# EAGLE design emonTH V3.0.0 (EAGLE 9.6.2)
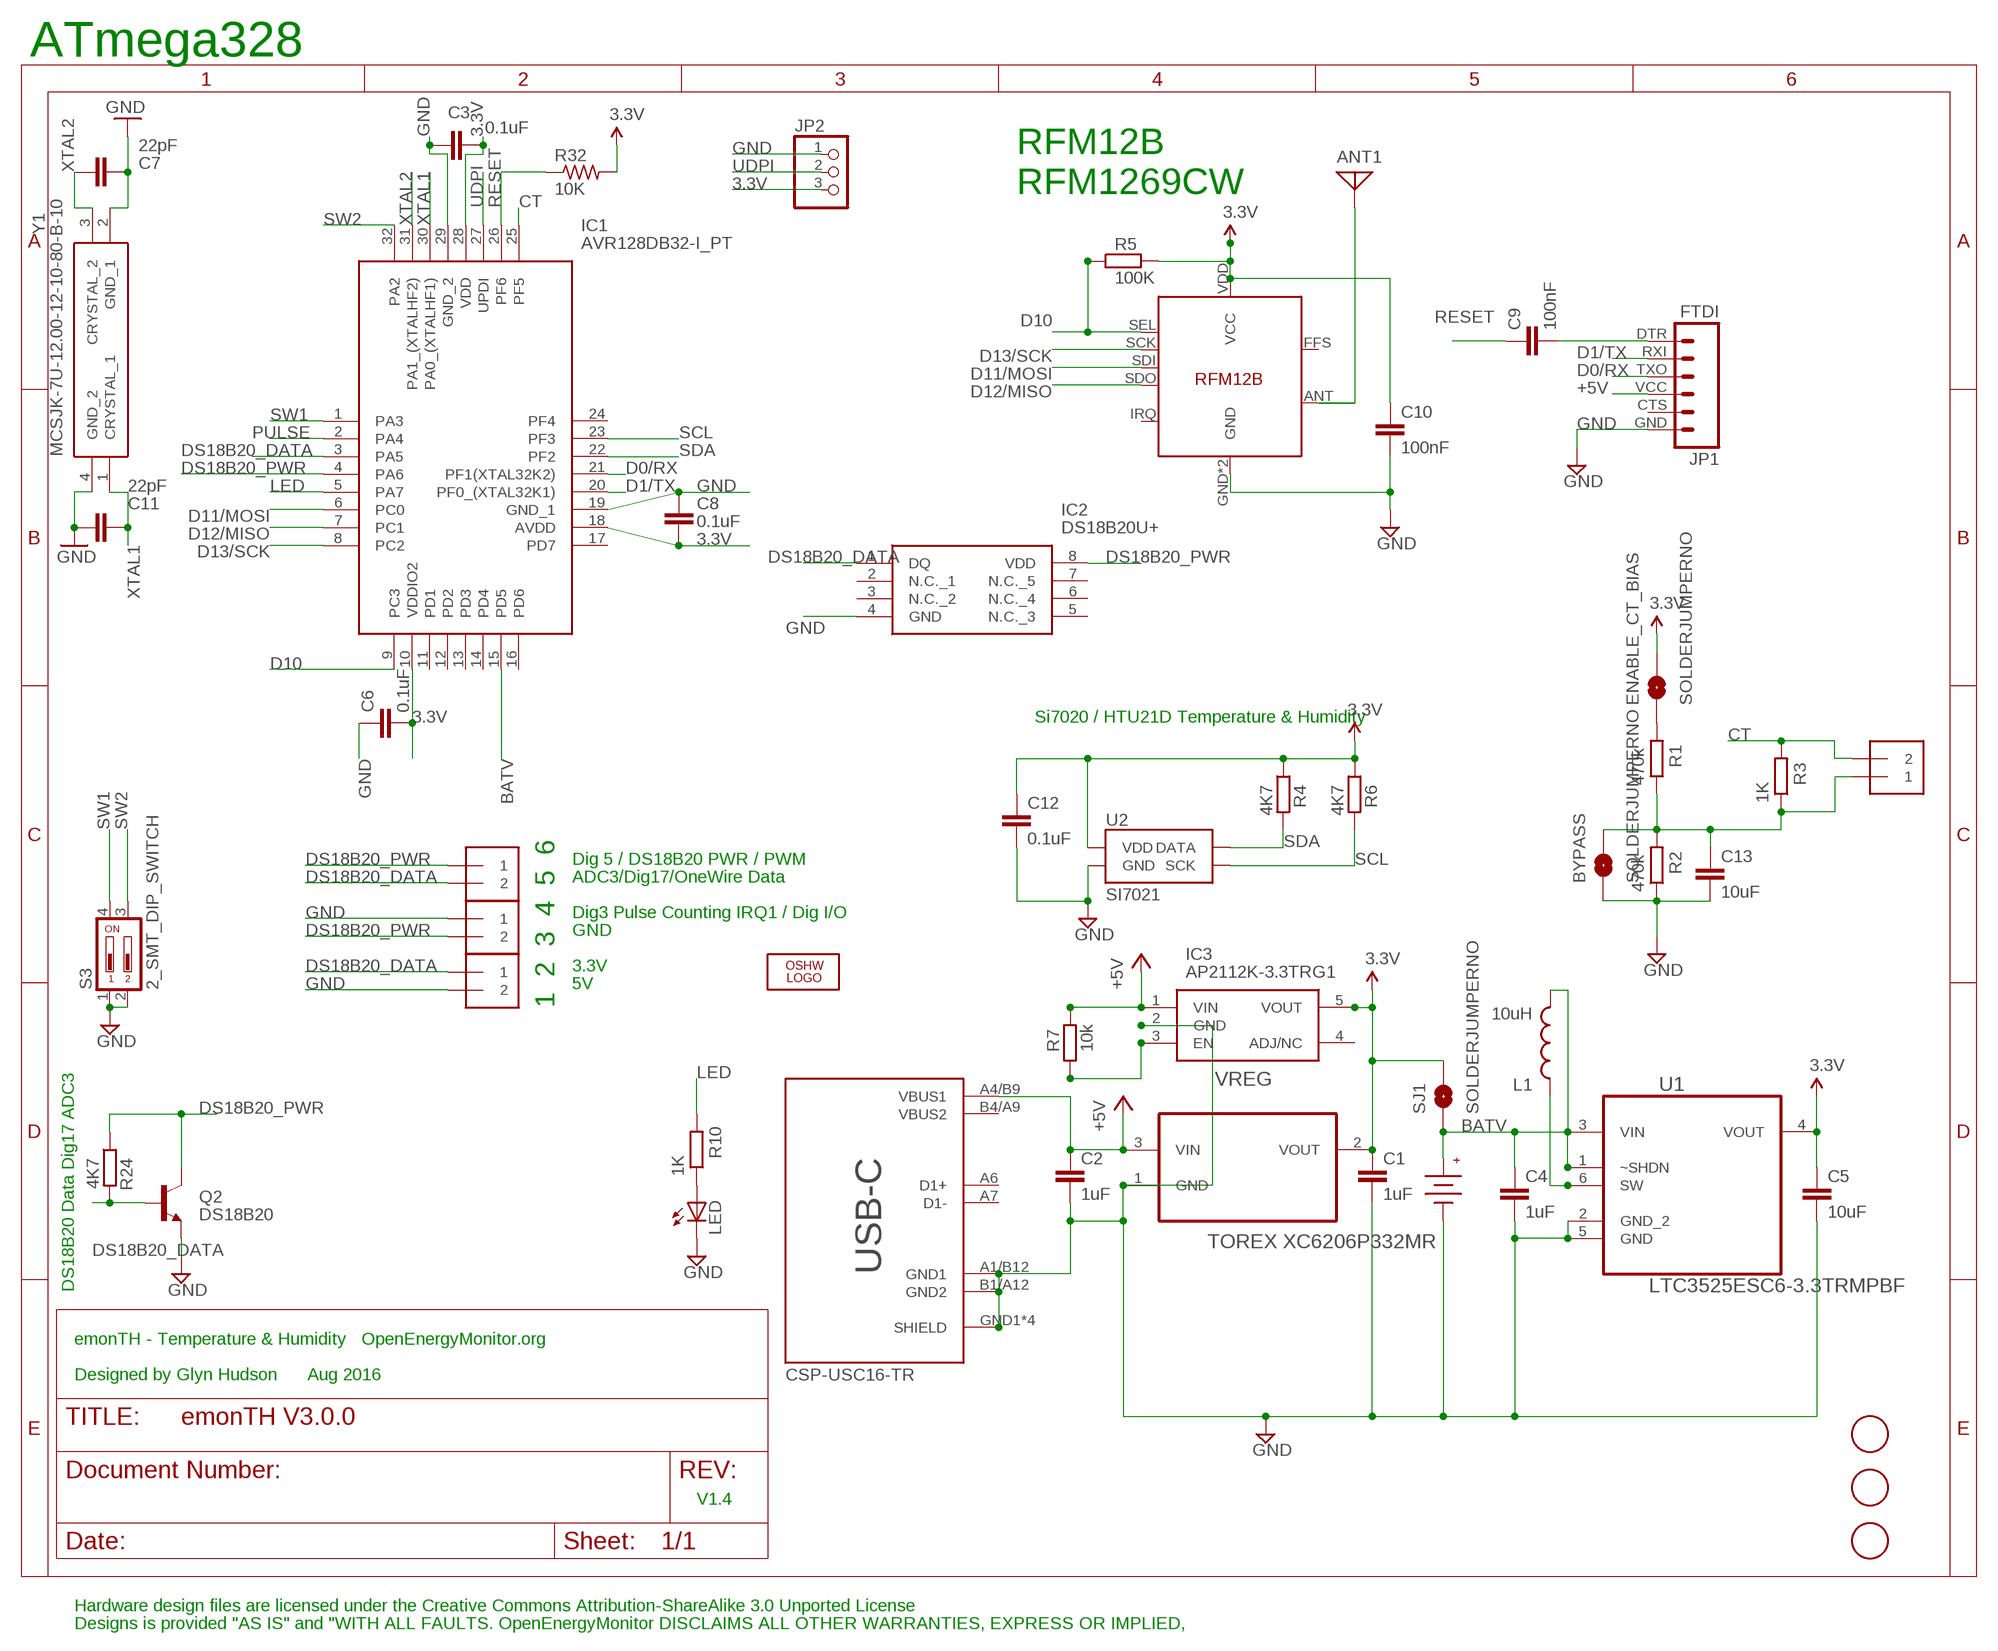
[diagram p0: schematic, sheet 1]

## Parts
ANT1  ANTENNA  [PAD-01]
BYPASS  SOLDERJUMPERNO  [SJ_2S-NO]
C1  1uF  C-EUC0603  [C0603]
C2  1uF  C-EUC0603  [C0603]
C3  0.1uF  C-EUC0603  [C0603]
C4  1uF  C-EUC0603  [C0603]
C5  10uF  C-EUC0603  [C0603]
C6  0.1uF  C-EUC0603  [C0603]
C7  22pF  C-EUC0603  [C0603]
C8  0.1uF  C-EUC0603  [C0603]
C9  100nF  C-EUC0603  [C0603]
C10  100nF  C-EUC0603  [C0603]
C11  22pF  C-EUC0603  [C0603]
C12  0.1uF  C-EUC0603  [C0603]
C13  10uF  C-EUC0603  [C0603]
ENABLE_CT_BIAS  SOLDERJUMPERNO  [SJ_2S-NO]
IC1  AVR128DB32-I_PT  [QFP80P900X900X120-32N]
IC2  DS18B20U+  [SOP65P490X110-8N]
IC3  AP2112K-3.3TRG1  [SOT95P282X130-5N]
J1  1X2-3.5MM  [1X2-3.5MM]
J2  1X2-3.5MM  [1X2-3.5MM]
J3  1X2-3.5MM  [1X2-3.5MM]
J4  1X2-3.5MM  [1X2-3.5MM]
JP1  FTDI  FTDI_BASICPTH  [FTDI_BASIC]
JP2  PINHD-1X3  [1X03]
L1  10uH  INDUCTOR1210  [1210]
LED  LEDCHIPLED-0603-TTW  [CHIPLED-0603-TTW]
LOGO2  OSHW_LOGO_10MILX0200-NT  [OSHW_10X200_NOTEXT]
Q2  DS18B20  TRANSISTOR_NPNTO92  [TO-92]
R1  470k  R-EU_R0603  [R0603]
R2  470k  R-EU_R0603  [R0603]
R3  1K  R-EU_R0603  [R0603]
R4  4K7  R-EU_R0603  [R0603]
R5  100K  R-EU_R0603  [R0603]
R6  4K7  R-EU_R0603  [R0603]
R7  10k  R-EU_R0603  [R0603]
R10  1K  R-EU_R0603  [R0603]
R24  4K7  R-EU_R0603  [R0603]
R32  10K  R-US_R0603  [R0603]
RFM69CW  RFM12B  [RFM12B]
S3  2_SMT_DIP_SWITCH  [DIP_SWITCH_SMT]
SJ1  SOLDERJUMPERNO  [SJ_2S-NO]
U1  LTC3525ESC6-3.3TRMPBF  [SOT65P210X100-6N]
U2  SI7021  [SI7021]
U$1  FIDUCIAL  [FIDUCIAL_1MM]
U$3  3V  3X_AAA_BATTERY_HOLDER  [AAA_PCB_HOLDER]
U$6  FIDUCIAL  [FIDUCIAL_1MM]
U$7  FIDUCIAL  [FIDUCIAL_1MM]
USB-C  CSP-USC16-TR  [USB-C]
VREG  TOREX XC6206P332MR  MCP1700T-3302E/TT  [SOT95P237X112-3N]
Y1  MCSJK-7U-12.00-12-10-80-B-10  [MCSJK7U1200121080B10]

## Nets
3.3V: C1.1 C3.1 C5.1 C6.2 C8.2 C10.1 C12.1 ENABLE_CT_BIAS.2 IC1.10(VDDIO2) IC1.18(AVDD) IC1.28(VDD) IC3.5(VOUT) JP2.3 R4.1 R5.2 R6.1 R32.2 RFM69CW.VDD(VCC) SJ1.2 U1.4(VOUT) U2.VDD VREG.2(VOUT)
+5V [power]: C2.1 IC3.1(VIN) JP1.VCC R7.2 USB-C.A4/B9(VBUS1) VREG.3(VIN)
BATV: C4.1 IC1.15(PD5) L1.2 SJ1.1 U1.1(~SHDN) U1.3(VIN) U$3.+
CT: IC1.25(PF5) J4.2 R3.2
D0/RX: IC1.21(PF1(XTAL32K2)) JP1.TXO
D1/TX: IC1.20(PF0_(XTAL32K1)) JP1.RXI
D10: IC1.9(PC3) R5.1 RFM69CW.SEL
D11/MOSI: IC1.6(PC0) RFM69CW.SDI
D12/MISO: IC1.7(PC1) RFM69CW.SDO
D13/SCK: IC1.8(PC2) RFM69CW.SCK
DIG1: ANT1.1 RFM69CW.ANT
DS18B20_DATA: IC1.3(PA5) IC2.1(DQ) J1.2 J3.1 Q2.2(B) R24.2
DS18B20_PWR: IC1.4(PA6) IC2.8(VDD) J1.1 J2.2 Q2.3(C) R24.1
GND [gnd]: BYPASS.1 C1.2 C2.2 C3.2 C4.2 C5.2 C6.1 C7.1 C8.1 C10.2 C11.2 C12.2 C13.2 IC1.19(GND_1) IC1.29(GND_2) IC2.4(GND) IC3.2(GND) J2.1 J3.2 JP1.GND JP2.1 LED.C Q2.1(E) R2.1 RFM69CW.GND RFM69CW.P$12(GND) S3.1 S3.2 U1.2(GND_2) U1.5(GND) U2.GND U$3.- USB-C.A1/B12(GND1) USB-C.B1/A12(GND2) USB-C.GND1(SHIELD) USB-C.GND2(SHIELD) USB-C.GND3(SHIELD) USB-C.GND4(SHIELD) VREG.1(GND) Y1.2(GND_1) Y1.4(GND_2)
LED: IC1.5(PA7) R10.2
N$1: LED.A R10.1
N$2: ENABLE_CT_BIAS.1 R1.2
N$3: BYPASS.2 C13.1 J4.1 R1.1 R2.2 R3.1
N$5: L1.1 U1.6(SW)
N$13: IC3.3(EN) R7.1
N$23: C9.2 JP1.DTR
PULSE: IC1.2(PA4)
RESET: C9.1 IC1.26(PF6) R32.1
SCL: IC1.23(PF3) R6.2 U2.SCK
SDA: IC1.22(PF2) R4.2 U2.DATA
SW1: IC1.1(PA3) S3.4
SW2: IC1.32(PA2) S3.3
UDPI: IC1.27(UPDI) JP2.2
XTAL1: C11.1 IC1.30(PA0_(XTALHF1)) Y1.1(CRYSTAL_1)
XTAL2: C7.2 IC1.31(PA1_(XTALHF2)) Y1.3(CRYSTAL_2)
Unconnected: IC1.11(PD1) IC1.12(PD2) IC1.13(PD3) IC1.14(PD4) IC1.16(PD6) IC1.17(PD7) IC1.24(PF4) IC2.2(N.C._1) IC2.3(N.C._2) IC2.5(N.C._3) IC2.6(N.C._4) IC2.7(N.C._5) IC3.4(ADJ/NC) JP1.CTS RFM69CW.FFS RFM69CW.IRQ USB-C.A6(D1+) USB-C.A7(D1-) USB-C.B4/A9(VBUS2)

## Notes on the sheet
- ATmega328
- RFM12B
  RFM1269CW
- Si7020 / HTU21D Temperature & Humidity
- Dig 5 / DS18B20 PWR / PWM
- ADC3/Dig17/OneWire Data
- Dig3 Pulse Counting IRQ1 / Dig I/O
- GND
- 3.3V
- 5V
- 1  2  3  4  5  6
- DS18B20 Data Dig17 ADC3
- emonTH - Temperature & Humidity   OpenEnergyMonitor.org
- Designed by Glyn Hudson      Aug 2016
- V1.4
- Hardware design files are licensed under the Creative Commons Attribution-ShareAlike 3.0 Unported License
- Designs is provided "AS IS" and "WITH ALL FAULTS. OpenEnergyMonitor DISCLAIMS ALL OTHER WARRANTIES, EXPRESS OR IMPLIED,

## Library data of the parts
ANT1 = discrete:ANTENNA: Antenna
BYPASS ENABLE_CT_BIAS SJ1 = SparkFun:SOLDERJUMPER: Solder Jumper Standard SMD solder jumper. Used to automate production. Two varients : Normally Open and Normally Closed are the same, but have different paste layers. NC will have a large amount of paste and should jumper during reflow.
C1 C2 C4-C8 C11-C13 = resistor:C-EU: CAPACITOR, European symbol
C3 C9 C10 = rcl:C-EU: CAPACITOR, European symbol
IC1 = AVR128DB32-I_PT:AVR128DB32-I_PT: 128KB, TQFP32, 85C, 24MHZ, 12B ADC, COMP, OPAMP, MVIO, ZCD, DAC, UART, SPI, TWI, 32 TQFP 7X7X1MM TRAY ROHS COMPLIANT: YES Source: Datasheet <http://ww1.microchip.com/downloads/en/DeviceDoc/AVR128DB28-32-48-64-DataSheet-DS40002247A.pdf>; ARROW_PART_NUMBER: AVR128DB32-I/PT; ARROW_PRICE-STOCK: https://www.arrow.com/en/products/avr128db32-ipt/microchip-technology?region=nac; DESCRIPTION: 128KB, TQFP32, 85C, 24MHZ, 12B ADC, COMP, OPAMP, MVIO, ZCD, DAC, UART, SPI, TWI, 32 TQFP 7X7X1MM TRAY ROHS COMPLIANT: YES; HEIGHT: 1.2mm; MANUFACTURER_NAME: Microchip; MANUFACTURER_PART_NUMBER: AVR128DB32-I/PT; MOUSER_PART_NUMBER: 579-AVR128DB32-I/PT; MOUSER_PRICE-STOCK: https://www.mouser.co.uk/ProductDetail/Microchip-Technology/AVR128DB32-I-PT?qs=vmHwEFxEFR%252BrKeBb9KOKBg%3D%3D
IC2 = DS18B20U+:DS18B20U+: Board Mount Temperature Sensors Prgmble Resolution 1-Wire Parasite Pwr Source: Datasheet <https://datasheets.maximintegrated.com/en/ds/DS18B20.pdf>; ARROW_PART_NUMBER: DS18B20U+; ARROW_PRICE-STOCK: https://www.arrow.com/en/products/ds18b20u/maxim-integrated?region=nac; DESCRIPTION: Board Mount Temperature Sensors Prgmble Resolution 1-Wire Parasite Pwr; HEIGHT: 1.1mm; MANUFACTURER_NAME: Maxim Integrated; MANUFACTURER_PART_NUMBER: DS18B20U+; MOUSER_PART_NUMBER: 700-DS18B20U; MOUSER_PRICE-STOCK: https://www.mouser.co.uk/ProductDetail/Maxim-Integrated/DS18B20U%2b?qs=7H2Jq%252ByxpJLxAEcPXZtrFQ%3D%3D
IC3 = AP2112K-3.3TRG1:AP2112K-3.3TRG1: 600mA 3.3V LDO Regulator Enable SOT23-5 DiodesZetex AP2112K-3.3TRG1, LDO Voltage Regulator, 3.3 V +/-1.5%, 2.5 6 Vin, 5-Pin SOT-23 Source: Datasheet <http://uk.rs-online.com/web/p/products/8283509>; ARROW_PART_NUMBER: AP2112K-3.3TRG1; ARROW_PRICE-STOCK: https://www.arrow.com/en/products/ap2112k-3.3trg1/diodes-incorporated?region=nac; DESCRIPTION: 600mA 3.3V LDO Regulator Enable SOT23-5 DiodesZetex AP2112K-3.3TRG1, LDO Voltage Regulator, 3.3 V +/-1.5%, 2.5 6 Vin, 5-Pin SOT-23; HEIGHT: 1.3mm; MANUFACTURER_NAME: Diodes Inc.; MANUFACTURER_PART_NUMBER: AP2112K-3.3TRG1; MOUSER_PART_NUMBER: 621-AP2112K-3.3TRG1; MOUSER_PRICE-STOCK: https://www.mouser.co.uk/ProductDetail/Diodes-Incorporated/AP2112K-33TRG1?qs=x6A8l6qLYDDPYHosCdzh%2FA%3D%3D
J1-J4 = adafruit:1X2: 3.5mm Terminal block http://www.ladyada.net/library/pcb/eaglelibrary.html
JP1 = SparkFun:FTDI_BASIC: FTDI Basic: 3.3V and 5V
JP2 = adafruit:PINHD-1X3: PIN HEADER
L1 = SparkFun:INDUCTOR: Inductors Basic Inductor/Choke - 0603 and 1206. Footprints are not proven and vary greatly between part numbers.
LED = adafruit:LED: LED OSRAM: - CHIPLED LG R971, LG N971, LY N971, LG Q971, LY Q971, LO R971, LY R971 LH N974, LH R974 LS Q976, LO Q976, LY Q976 LO Q996 - Hyper CHIPLED LW Q18S LB Q993, LB Q99A, LB R99A - SideLED LS A670, LO A670, LY A670, LG A670, LP A670 LB A673, LV A673, LT A673, LW A673 LH A674 LY A675 LS A676, LA A676, LO A676, LY A676, LW A676 LS A679, LY A679, LG A679 - Hyper Micro SIDELED® LS Y876, LA Y876, LO Y876, LY Y876 LT Y87S - SmartLED LW L88C, LW L88S LB L89C, LB L89S, LG L890 LS L89K, LO L89K, LY L89K LS L896, LA L896, LO L896, LY L896 - TOPLED LS T670, LO T670, LY T670, LG T670, LP T670 LSG T670, LSP T670, LSY T670, LOP T670, LYG T670 LG T671, LOG T671, LSG T671 LB T673, LV T673, LT T673, LW T673 LH T674 LS T676, LA T676, LO T676, LY T676, LB T676, LH T676, LSB T676, LW T676 LB T67C, LV T67C, LT T67C, LS T67K, LO T67K, LY T67K, LW E67C LS E67B, LA E67B, LO E67B, LY E67B, LB E67C, LV E67C, LT E67C LW T67C LS T679, LY T679, LG T679 LS T770, LO T770, LY T770, LG T770, LP T770 LB T773, LV T773, LT T773, LW T773 LH T774 LS E675, LA E675, LY E675, LS T675 LS T776, LA T776, LO T776, LY T776, LB T776 LHGB T686 LT T68C, LB T68C - Hyper Mini TOPLED® LB M676 - Mini TOPLED Santana® LG M470 LS M47K, LO M47K, LY M47K Source: http://www.osram.convergy.de/
LOGO2 = ohw-logo:OSHW_LOGO_10MIL
Q2 = SparkFun:TRANSISTOR_NPN: Transistor NPN BJT configuration in SOT23 package. MMBT2222 is the common NPN we use. Double check BCE configuration again layout.
R1-R4 R6 R10 R24 = resistor:R-EU_: RESISTOR, European symbol
R5 R7 = rcl:R-EU_: RESISTOR, European symbol
R32 = adafruit:R-US_: RESISTOR, American symbol
RFM69CW = JeeParts:RFM12B
S3 = OpenEnergyMonitor:2_SMT_DIP_SWITCH: Multicomp MCEMR-02-T 2 throw SMT DIP switch, Farnell 1524005
U1 = LTC3525:LTC3525ESC6-3.3TRMPBF: Step-Up DC/DC Converter; MPN: LTC3525ESC6-3.3#TRMPBF; OC_FARNELL: 1663904; OC_NEWARK: 19P0692; PACKAGE: SC70-6; SUPPLIER: LINEAR TECHNOLOGY
U2 = SparkFun-Sensors:SI7021: The Si7021 is an I2C Humidity and Temperature Sensor; PROD_ID: IC-13093
U$1 U$6 U$7 = adafruit:FIDUCIAL: For use by pick and place machines to calibrate the vision/machine, 1mm By microbuilder.eu
U$3 = Battery Holders_2xAA:3X_AAA_BATTERY_HOLDER: 2x AA Battery Holder; RAPID_OC: 18-2967
USB-C = CSP-USC16-TR:CSP-USC16-TR: CSP-USC16-TR TOBY.CO.UK; MPN: CSP-USC16-TR
VREG = Farnell_MCP1700-SOT23:MCP1700T-3302E/TT: Low Quiescent Current LDO; MPN: MCP1700T-3302E/TT; OC_FARNELL: 1296592; OC_NEWARK: 88H9817; PACKAGE: SOT23-3; SUPPLIER: Microchip
Y1 = MCSJK-7U-12.00-12-10-80-B-10:MCSJK-7U-12.00-12-10-80-B-10: CRYSTAL, 12MHZ, 12PF, 3.2MM X 2.5MM Source: Datasheet <https://componentsearchengine.com/Datasheets/2/MCSJK-7U-12.00-12-10-80-B-10.pdf>; DESCRIPTION: CRYSTAL, 12MHZ, 12PF, 3.2MM X 2.5MM; HEIGHT: 0.8mm; MANUFACTURER_NAME: MULTICOMP; MANUFACTURER_PART_NUMBER: MCSJK-7U-12.00-12-10-80-B-10

## Net classes
0 default: width 0.203 mm, drill 0.6 mm, clearance 0.203 mm
1 power: width 0.305 mm, drill 0.6 mm, clearance 0.254 mm
2 gnd: width 0.254 mm, drill 0.6 mm, clearance 0.254 mm

## Board
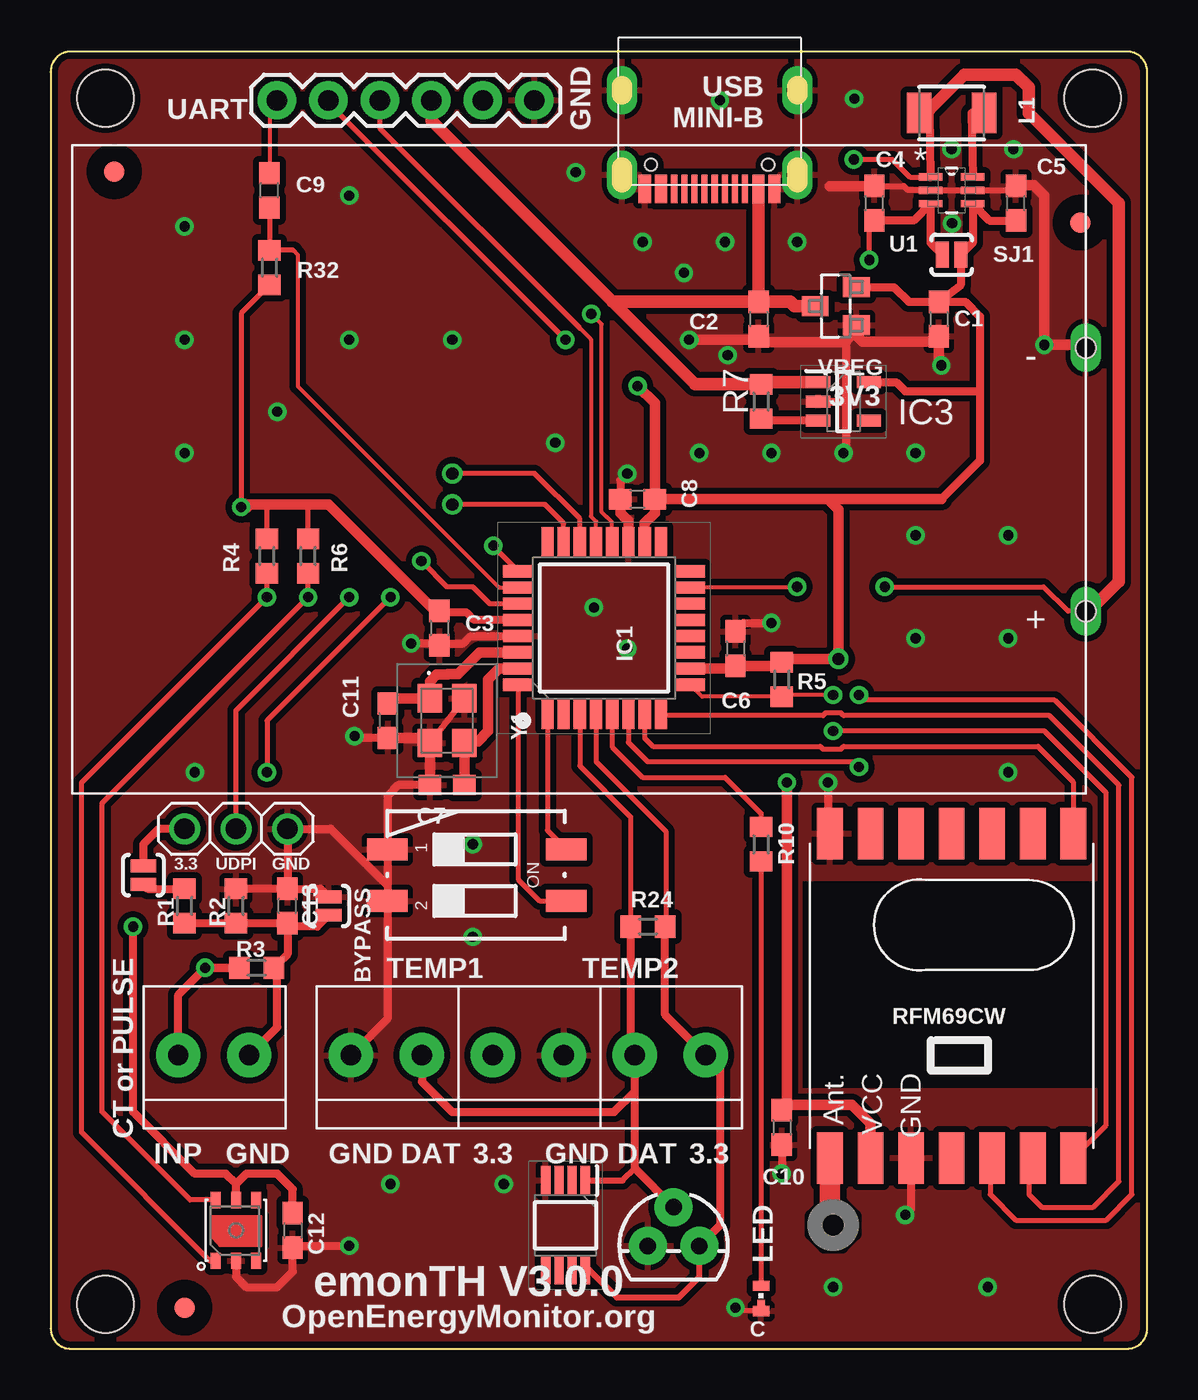
[diagram p1: board, top side]
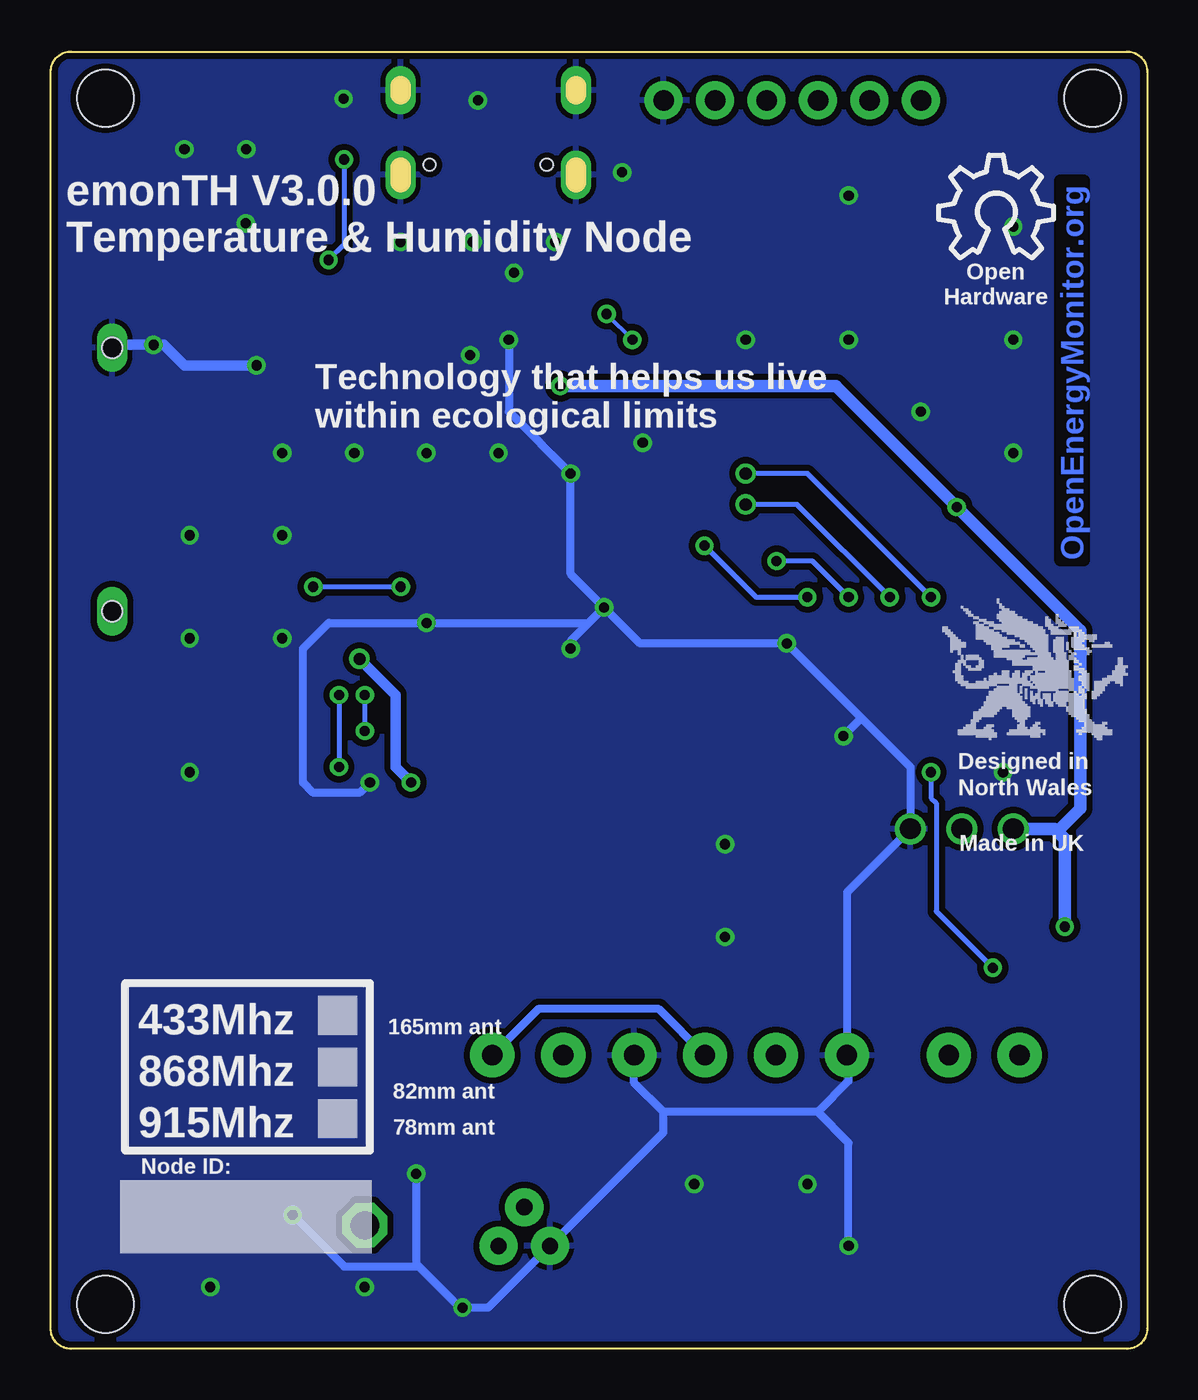
[diagram p2: board, bottom side, seen from below]

Size 54.1 x 64 mm. Coordinates in mm from the lower left corner, seen from the top.
Outline: 53.1,64 1,64 arc90 0,63 0,1 arc90 1,0 53.1,0 arc90 54.1,1 54.1,63 arc90 53.1,64
Copper layers (1*16): Top 0.035mm / dielectric 1.5mm / Bottom 0.035mm
Design rules "default *": minimum track width 8mil, minimum drill 0.5mm, track to track 8mil, track to pad 8mil, pad to pad 8mil, via to via 8mil, smd to smd 8mil, copper to edge 10mil, drill to drill 8mil, minimum pad ring 8mil, minimum via ring 8mil, stop-mask expansion 0.075mm, vias tented up to drill 0.6mm, thermal gap 10mil
Holes 2.8 mm at 2.7,2.2 2.7,61.7 51.4,61.7 51.4,2.2

### Footprints (pad centres in the part's own frame; a part is rotated, then mirrored left to right if it is on the bottom)
PAD-01 = drill 1.4 pad 2.2 octagon: 1 0,0
SJ_2S-NO = smd 0.635 x 1.27: 1 -0.45,0; 2 0.45,0
C0603 = smd 1.1 x 1: 1 -0.85,0; 2 0.85,0
QFP80P900X900X120-32N = smd 1.475 x 0.6: 1 -4.238,2.8; 2 -4.238,2; 3 -4.238,1.2; 4 -4.238,0.4; 5 -4.238,-0.4; 6 -4.238,-1.2; 7 -4.238,-2; 8 -4.238,-2.8; 17 4.238,-2.8; 18 4.238,-2; 19 4.238,-1.2; 20 4.238,-0.4; 21 4.238,0.4; 22 4.238,1.2; 23 4.238,2; 24 4.238,2.8 | smd 0.6 x 1.475: 9 -2.8,-4.238; 10 -2,-4.238; 11 -1.2,-4.238; 12 -0.4,-4.238; 13 0.4,-4.238; 14 1.2,-4.238; 15 2,-4.238; 16 2.8,-4.238; 25 2.8,4.238; 26 2,4.238; 27 1.2,4.238; 28 0.4,4.238; 29 -0.4,4.238; 30 -1.2,4.238; 31 -2,4.238; 32 -2.8,4.238
SOP65P490X110-8N = smd 1.425 x 0.45: 1 -2.212,0.975; 2 -2.212,0.325; 3 -2.212,-0.325; 4 -2.212,-0.975; 5 2.212,-0.975; 6 2.212,-0.325; 7 2.212,0.325; 8 2.212,0.975
SOT95P282X130-5N = smd 1.2 x 0.6: 1 -1.25,0.95; 2 -1.25,0; 3 -1.25,-0.95; 4 1.25,-0.95; 5 1.25,0.95
1X2-3.5MM = drill 1 pad 2.184: 1 1.8,0; 2 -1.7,0
FTDI_BASIC = drill 1.016 pad 1.88: CTS 10.16,0; DTR 0,0; GND 12.7,0; RXI 2.54,0; TXO 5.08,0; VCC 7.62,0
1X03 = drill 1.016: 1 -2.54,0; 2 0,0; 3 2.54,0
1210 = smd 1.2 x 2: 1 -1.6,0; 2 1.6,0
CHIPLED-0603-TTW = smd 0.8 x 0.5: A 0,-0.575; C 0,0.675 | smd 0.35 x 0.35: C@1 0,0.3
TO-92 = drill 0.813 pad 1.88: 1 -1.27,0; 2 0,1.905; 3 1.27,0
R0603 = smd 1 x 1.1: 1 -0.85,0; 2 0.85,0
RFM12B = smd 2.54 x 1.27: ANT 8,-6; FFS -8,2; GND 8,-2; IRQ -8,4; P$8 -8,0; P$9 -8,-2; P$10 -8,-4; P$12 -8,-6; P$16 8,0; SCK 8,4; SDI 8,2; SDO -8,6; SEL 8,6; VDD 8,-4
DIP_SWITCH_SMT = smd 1.1 x 2: 1 -1.27,-4.215; 2 1.27,-4.215; 3 1.27,4.615; 4 -1.27,4.615
SOT65P210X100-6N = smd 1.168 x 0.356: 1 -1.041,0.66; 2 -1.041,0; 3 -1.041,-0.66; 4 1.041,-0.66; 5 1.041,0; 6 1.041,0.66
SI7021 = smd 0.8 x 0.5: DATA 1.5,-1; GND 1.5,0; NC@3 1.5,1; NC@4 -1.5,1; SCK -1.5,-1; VDD -1.5,0
FIDUCIAL_1MM = smd 1 x 1: 1 0,0
AAA_PCB_HOLDER = drill 1 long: + 0,9; - 0,22 | hole 1: 0,9; 0,22
USB-C = smd 0.6 x 1.4: A1/B12 -3.2,0.7; A4/B9 -2.4,0.7; B1/A12 3.2,0.7; B4/A9 2.4,0.7 | smd 0.3 x 1.4: A5 -1.25,0.7; A6 -0.25,0.7; A7 0.25,0.7; A8 1.25,0.7; B5 1.75,0.7; B6 0.75,0.7; B7 -0.75,0.7; B8 -1.75,0.7 | drill 1 pad 1.2 long: GND1 -4.32,0; GND2 4.33,0; GND3 4.33,-4.18; GND4 -4.32,-4.18 | hole 0.6: -2.89,-0.5; 2.89,-0.5
SOT95P237X112-3N = smd 0.991 x 1.321: 1 -0.94,-1.016; 2 0.94,-1.016; 3 0,1.016
MCSJK7U1200121080B10 = smd 1.4 x 1.2: 1 -1.1,-0.85; 2 1.1,-0.85; 3 1.1,0.85; 4 -1.1,0.85

### Placement (x,y rotation side)
ANT1  38.61,6.1 0 top
BYPASS  13.72,21.84 270 top
C1  43.81,50.8 270 top
C2  34.92,50.8 270 top
C3  19.18,35.56 270 top
C4  40.64,56.52 90 top
C5  47.62,56.52 90 top
C6  33.78,34.54 270 top
C7  19.56,27.81 0 top
C8  28.96,41.91 0 top
C9  10.79,57.15 90 top
C10  36.07,10.92 270 top
C11  16.64,30.99 270 top
C12  11.94,5.84 270 top
C13  11.68,21.84 90 top
ENABLE_CT_BIAS  4.57,23.37 90 top
IC1  27.3,35.56 90 top
IC2  25.4,6.1 270 top
IC3  39.12,46.74 0 top
J1  30.52,14.48 0 top
J2  23.52,14.48 0 top
J3  16.52,14.48 0 top
J4  7.99,14.48 0 top
JP1  11.16,61.59 0 top
JP2  9.14,25.65 180 top
L1  44.45,60.96 180 top
LED  35.05,2.54 180 top
LOGO2  10.29,53.81 0 bottom
Q2  30.73,5.08 0 top
R1  6.6,21.84 90 top
R2  9.14,21.84 270 top
R3  10.16,18.8 180 top
R4  10.67,39.12 270 top
R5  36.07,33.02 90 top
R6  12.7,39.12 270 top
R7  35.05,46.74 90 top
R10  35.05,24.89 90 top
R24  29.46,20.83 180 top
R32  10.79,53.34 270 top
RFM69CW  44.45,17.41 270 top
S3  20.83,23.37 270 top
SJ1  44.45,53.98 0 top
U1  44.45,57.15 0 top
U2  9.14,5.84 270 top
U$1  6.6,2.03 0 top
U$3  51.07,27.39 0 top
U$6  3.13,58.08 0 top
U$7  50.8,55.56 0 top
USB-C  32.51,57.91 180 top
VREG  38.73,51.44 90 top
Y1  19.56,30.99 270 top

### Tracks (layer width: path | path; a pad name or v marks a point on that pad's centre or on a via)
3.3V  (via drill 0.5, 0.6)
  Top 0.254: R32.2 9.4,51.09 v9.4,41.53 | 12.7,40.13 R6.1 12.7,41.66 | R4.1 10.67,41.66
  Top 0.406: C1.1 44.9,52.48 SJ1.2 45.49,54.57 U1.4 46.32,55.66 C5.1 | VREG.2 41.6,52.38 42.33,51.65 C1.1 | C1.1 45.12,51.65 45.85,50.93 45.85,47.24 | 45.85,47.24 45.85,43.81 43.94,41.91 | IC1.28 20.9,35.96 20.54,36.32 19.27,36.32 C3.1 | C12.1 11.94,7.87 11.18,8.64 9.65,8.64 9.14,8.13 | JP2.3 5.33,25.65 4.57,24.89 ENABLE_CT_BIAS.2 | U2.VDD 9.14,8.13 | 9.14,8.13 8.64,8.64 7.11,8.64 4.06,11.68 v4.06,20.83 | 36.23,34.04 R5.2 35.89,33.69 | IC3.5 41.72,47.69 42.16,47.24 45.85,47.24
  Top 0.508: IC1.10 33.65,33.56 C6.2 35.89,33.69 | IC1.18 29.3,40.73 29.81,41.24 C8.2 | 38.35,41.91 38.86,41.4 v38.86,34.04 | 43.94,41.91 38.35,41.91 | 38.35,41.91 C8.2 | v28.96,47.5 29.81,46.65 C8.2 | 38.77,34.12 v38.86,34.04 | v36.32,27.94 36.32,12.03 | 36.32,12.03 39.54,12.03 40.45,11.11 RFM69CW.VDD | 9.53,41.66 10.67,41.66 12.7,41.66 13.72,41.66 19.05,36.32 19.27,36.32 | 36.23,34.04 v38.86,34.04 | C10.1 36.32,12.03
  Top 0.61: 9.65,41.53 v9.4,41.53 9.53,41.66 | C3.1 19.09,36.32
  Bottom 0.406: 4.57,25.65 4.32,25.65
  Bottom 0.508: v36.32,27.94 37.08,28.7 37.08,32.26 v38.86,34.04
  Bottom 0.61: v28.96,47.5 15.37,47.5 v9.4,41.53 3.3,35.43 3.3,26.67 4.32,25.65 | JP2.3 4.57,25.65 4.06,25.15 v4.06,20.83
+5V
  Top 0.254: 34.62,51.65 C2.1
  Top 0.406: R7.2 35.07,47.6 35.3,47.6 35.38,47.69
  Top 0.61: 27.73,51.65 18.78,60.59 JP1.VCC | 27.73,51.65 C2.1 | C2.1 36.49,51.65 36.7,51.44 VREG.3 | 35.38,47.69 IC3.1 | R7.2 31.79,47.59 27.73,51.65 | USB-C.A4/B9 34.91,51.66 C2.1
BATV  (via drill 0.5)
  Top 0.203: IC1.15 31.57,37.59 v36.83,37.59
  Top 0.254: 43.38,57.78 42.42,57.78 41.53,58.67 v39.62,58.67 | v40.39,53.72 40.39,55.41 C4.1 | v41.15,37.59 48.98,37.59 50.19,36.39 U$3.+
  Top 0.406: L1.2 43.34,60.97 | 43.34,60.97 U1.1 43.38,57.78 | SJ1.1 43.41,54.57 U1.3 42.58,55.66 C4.1 | 43.34,60.97 43.34,61.12
  Top 0.61: U$3.+ 51.25,36.39 52.7,37.85 52.7,56.52 48.26,60.96 48.26,62.23 47.62,62.87 45.09,62.87 43.34,61.12
  Bottom 0.254: v39.62,58.67 39.62,54.48 v40.39,53.72 | v36.83,37.59 v41.15,37.59
CT  (via drill 0.5)
  Top 0.254: IC1.25 21.84,39.58 v21.84,39.62 | v10.67,28.45 10.67,30.99 v16.76,37.08
  Top 0.406: v7.62,18.8 6.29,17.47 J4.2 | v7.62,18.8 R3.2 v7.62,18.8
  Bottom 0.254: v21.84,39.62 19.3,37.08 v16.76,37.08 | v10.67,28.45 10.67,27.18 10.41,26.92 10.41,21.59 v7.62,18.8
D0/RX
  Top 0.203: IC1.21 26.91,40.81 26.65,41.07 26.65,49.8 26.11,50.35
  Top 0.254: 26.11,50.35 16.26,60.2 16.26,61.58 JP1.TXO
D1/TX  (via drill 0.5)
  Top 0.203: IC1.20 27.69,39.82 27.69,40.79 27.43,41.05 27.41,41.05 27.18,41.28 27.18,50.55 v26.67,51.05
  Top 0.254: v25.4,49.78 13.7,61.48 JP1.RXI
  Bottom 0.203: v26.67,51.05 v25.4,49.78
D10  (via drill 0.5)
  Top 0.203: v38.61,32.26 36.16,32.26 R5.1 32.13,32.17 IC1.9
  Top 0.254: RFM69CW.SEL 52.07,11.04 52.07,27.43 49.02,30.48 v38.61,30.48
  Bottom 0.254: v38.61,32.26 v38.61,30.48
D11/MOSI  (via drill 0.5)
  Top 0.254: RFM69CW.SDI 46.35,9.32 46.35,7.62 47.62,6.35 52.07,6.35 53.34,7.62 53.34,28.19 49.53,32 40.13,32 v39.88,32.26 | IC1.6 28.5,29.91 29.46,28.96 39.62,28.96 v39.88,28.7
  Bottom 0.254: v39.88,32.26 v39.88,28.7
D12/MISO
  Top 0.254: RFM69CW.SDO 50.45,27.97 48.7,29.72 39.12,29.72 38.99,29.59 38.1,29.59 37.97,29.72 29.72,29.72 29.3,30.13 IC1.7 29.46,31.16
D13/SCK
  Top 0.254: RFM69CW.SCK 48.26,9.22 48.26,7.62 48.9,6.99 51.44,6.99 52.7,8.26 52.7,27.81 49.28,31.24 39.12,31.24 38.99,31.37 38.23,31.37 38.1,31.24 30.18,31.24 IC1.8
DIG1
  Top 1.016: 38.42,9.38 RFM69CW.ANT 38.45,6.25 ANT1.1
DS18B20_DATA
  Top 0.254: 28.61,21.34 R24.2 28.61,26.25 26.11,28.76 IC1.3
  Top 0.305: IC2.1 28.22,8.31 28.82,8.9
  Top 0.406: Q2.2 28.82,8.9 28.82,12.7 | 28.82,12.7 J1.2 28.61,14.69 R24.2 | J3.1 18.32,13.18 19.81,11.68 27.8,11.68 28.82,12.7
DS18B20_PWR
  Top 0.254: IC1.4 26.91,28.98 30.35,25.53 30.35,20.87
  Top 0.305: IC2.8 26.6,3.88 27.94,2.54 30.99,2.54 32,3.56 Q2.3
  Top 0.406: 30.35,20.87 R24.1 30.31,16.49 J1.1 33.02,13.78 33.02,6.1 Q2.3
  Bottom 0.406: J2.2 24.1,16.76 30.04,16.76 J1.1
GND  (via drill 0.5)
  Top 0.203: 47.75,57.15 47.47,57.15 | 40.68,57.4 C4.2
  Top 0.254: 15.01,30.21 v14.99,30.23 | LED.C 33.95,1.86
  Top 0.305: Y1.4 Y1.2 | C4.2 42.08,57.37 42.27,57.17 43.38,57.17 U1.2 U1.5 47.75,57.15
  Top 0.406: 47.47,57.15 C5.2 | C4.2 40.64,57.15 | IC1.29 20.72,35.16 20.36,34.8 19.27,34.8 C3.2 19.09,34.8 v17.78,34.8 | U2.GND 9.14,3.56 9.65,3.05 11.18,3.05 11.94,3.81 C12.2 12.03,5.08 v14.73,5.08 | C13.2 JP2.1 13.82,25.65 16.61,22.86 | C13.2 R2.1 | 14.73,14.4 J3.2 16.61,16.28 S3.2 16.61,22.86 | 16.61,22.86 S3.1 16.61,27.28 17.14,27.81 C7.1 | C6.1 34.2,35.81 v35.56,35.81 | C11.2 15.07,30.14 v14.99,30.23 | v38.35,27.94 38.35,25.48 38.44,25.4 | v28.45,43.18 28.11,42.84 C8.1 | C13.2 13.32,22.69 BYPASS.1 | C10.2 v36.07,8.64 | RFM69CW.GND 42.45,6.89 v42.16,6.6 | 33.95,1.86 v33.78,2.03 | IC3.2 39.12,46.74 39.24,46.86 | 39.24,49.73 39.24,46.86 | 39.24,46.86 39.24,44.32 v39.12,44.2
  Top 0.508: IC1.19 28.5,40.84 28.11,41.24 C8.1 | C7.1 Y1.2 18.46,30.14 C11.2 | 38.45,57.37 C4.2 | C5.2 47.66,57.4 48.51,57.4 49.02,56.9 v49.02,49.53 50.92,49.53 U$3.- | v31.5,49.78 34.76,49.78 C2.2 35.22,49.66 39.24,49.66 39.24,49.73 39.75,50.24 VREG.1 39.75,49.99 40.04,49.7 43.56,49.7 C1.2 43.81,48.64 v43.94,48.51
  Bottom 0.406: 16.26,11.68 14.73,13.21 14.73,14.4 J3.2 14.82,22.52 JP2.1 11.68,28.7 14.1,31.11 | 16.26,11.68 23.88,11.68 | 23.88,11.68 25.32,13.12 J2.1 | 23.88,11.68 23.88,10.67 Q2.1 32.51,2.03 v33.78,2.03 33.91,2.03 36.07,4.19 v36.07,8.64 | 14.1,31.11 v17.78,34.8 25.02,34.8 v26.8,36.58 | v14.99,30.23 14.1,31.11 | v26.8,36.58 28.45,38.23 v28.45,43.18 31.5,46.23 v31.5,49.78 | 27.56,35.81 28.45,34.92 v28.45,34.54 | 27.56,35.81 v35.56,35.81 40.39,35.81 41.66,34.54 41.66,27.94 41.15,27.43 38.86,27.43 v38.35,27.94 | 27.56,35.81 v26.8,36.58 | v14.73,5.08 14.73,10.16 16.26,11.68 | v42.16,6.6 39.62,4.06 36.07,4.06
  Bottom 0.508: v43.94,48.51 47.5,48.51 48.51,49.53 v49.02,49.53 50.92,49.53 U$3.-
  Bottom 0.61: U$3.- 51.05,49.4
  other vias: 25.91,58.04 33.4,49.02 44.45,59.18 47.5,59.18 39.65,61.67 44.48,55.52 14.73,56.9 14.73,49.78 11.18,46.23 47.24,28.45 42.67,35.05 47.24,35.05 47.24,40.13 42.67,40.13 42.67,44.2 32,44.2 24.89,44.7 19.81,49.78 6.6,49.78 6.6,55.37 6.6,44.2 33.02,61.59 20.83,24.89 20.83,20.32 16.76,8.13 22.35,8.13 7.11,28.45 29.21,54.61 31.24,53.09 33.27,54.61 36.83,54.61 35.56,44.2 38.61,3.05 46.23,3.05
  pour Bottom (isolate 0.305): -0.13,-0.13 54.1,-0.13 54.1,7.62 53.98,7.87 54.23,25.27 54.1,27.56 54.1,64.14 -0.13,64.14
  pour Top (isolate 0.305): 0,0 54.1,0 54.1,12.7 36.96,12.7 36.96,23.24 54.1,23.24 54.1,64.01 0,64.01
LED
  Top 0.254: R10.2 35.05,26.42 33.27,28.19 29.21,28.19 27.7,29.7 IC1.5
N$1
  Top 0.254: R10.1 LED.A
N$2
  Top 0.406: ENABLE_CT_BIAS.1 4.8,22.69 R1.2
  Top 0.508: 6.38,22.92 R1.2
N$3
  Top 0.406: R1.1 R2.2 C13.1 11.68,20.83 | 11.68,20.83 11.68,19.47 11.18,18.96 | 11.18,18.96 R3.1 | J4.1 11.18,15.87 11.18,18.96 | BYPASS.2 13.15,20.83 11.68,20.83
N$5
  Top 0.406: L1.1 45.43,60.97 U1.6
N$13
  Top 0.406: IC3.3 35.15,45.79 R7.1
N$23
  Top 0.203: JP1.DTR 10.79,61.23 C9.2
RESET
  Top 0.203: 11.98,54.19 12.19,53.98 12.19,47.5 22.13,37.56 IC1.26
  Top 0.254: C9.1 R32.1 11.98,54.19
SCL  (via drill 0.5, 0.6)
  Top 0.254: U2.SCK 6.88,7.34 2.54,11.68 2.54,26.92 v12.7,37.08 R6.2 | IC1.23 25.3,40.73 24.38,41.66 v19.81,41.66
  Bottom 0.254: v12.7,37.08 17.27,41.66 v19.81,41.66
SDA  (via drill 0.5, 0.6)
  Top 0.254: U2.DATA 7.85,4.34 1.52,10.67 1.52,27.94 v10.67,37.08 R4.2 | IC1.22 26.11,40.95 23.88,43.18 v19.81,43.18
  Bottom 0.254: v10.67,37.08 16.76,43.18 v19.81,43.18
SW1
  Top 0.254: IC1.1 24.5,25.58 S3.4
SW2
  Top 0.254: 26.16,22.1 S3.3 24.13,22.1 23.07,23.16 IC1.32
UDPI  (via drill 0.5)
  Top 0.254: JP2.2 9.14,31.5 v14.73,37.08 | v18.29,38.86 19.56,37.59 20.83,37.59 21.66,36.76 IC1.27
  Bottom 0.254: v14.73,37.08 16.51,38.86 v18.29,38.86
XTAL1
  Top 0.508: C11.1 16.89,32.09 Y1.1 18.71,32.93 19.05,33.27 19.56,33.27 19.58,33.27 19.6,33.3 20.09,33.3 21.15,34.36 IC1.30
XTAL2
  Top 0.508: C7.2 Y1.3 20.49,29.97 21.08,29.97 21.59,30.48 21.59,33.02 22.13,33.56 IC1.31

### Text on the board
Bottom: OpenEnergyMonitor.org
tPlace: USB / MINI-B | UART | GND | 3V3 | 3.3 | UDPI | GND | CT or PULSE | TEMP1 | TEMP2 | INP | GND | GND | DAT | 3.3 | GND | DAT | 3.3 | LED
bPlace: emonTH V3.0.0 / Temperature & Humidity Node | Open / Hardware | Technology that helps us live / within ecological limits | Designed in | North Wales | Made in UK
bNames: 165mm ant | 433Mhz | 868Mhz | 82mm ant | 78mm ant | 915Mhz | Node ID:
dxf: Note: v1.5 PCB Dimensions have been / widened so that drill holes are 48.7mm / appart to match case dimensions | REAR GRILL 35mm | FRONT GRILL 35mm
tSilk: emonTH V3.0.0 | OpenEnergyMonitor.org
_tsilk: Designed in | North Wales | Made in UK
_bsilk: 165mm ant | 433Mhz | 165mm ant | 165mm ant | 433Mhz | 433Mhz | 868Mhz | 82mm ant | 82mm ant | 82mm ant | 868Mhz | 868Mhz | 78mm ant | 915Mhz | 78mm ant | 915Mhz | 78mm ant | 915Mhz | 165mm ant | 433Mhz | 82mm ant | 868Mhz | 78mm ant | 915Mhz